# EAGLE design Fuente y sensor (EAGLE 5.08)
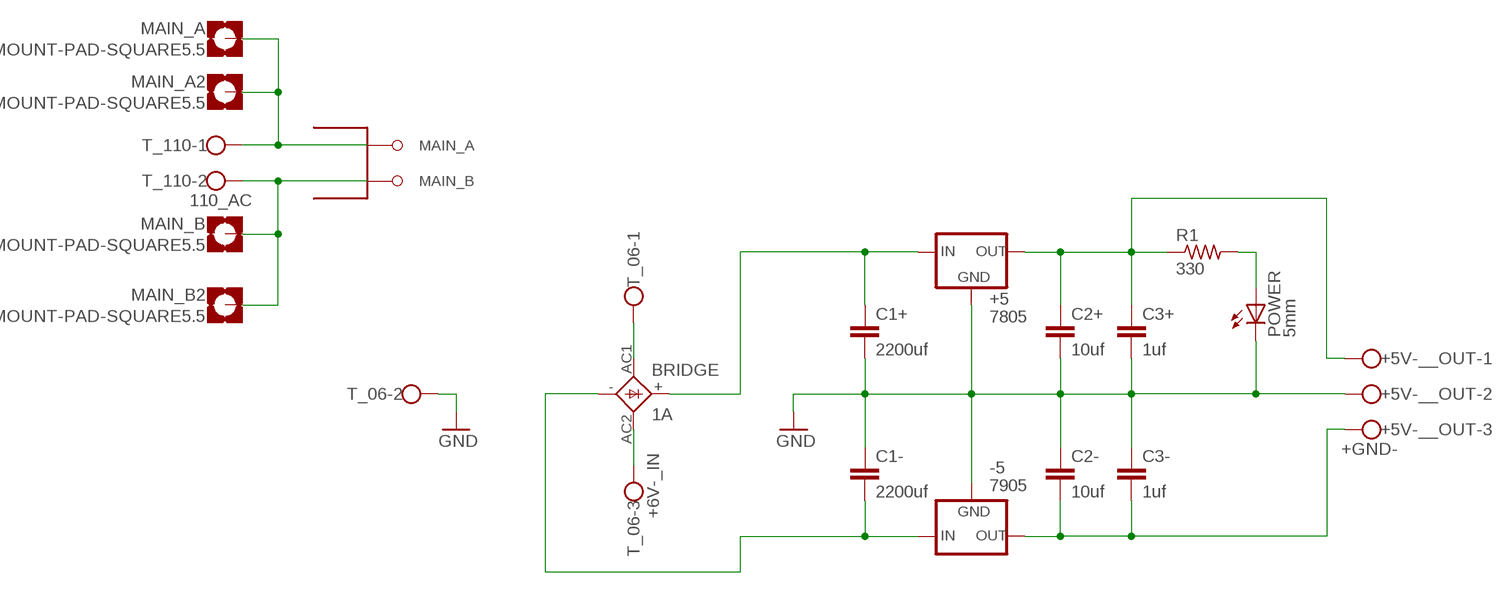
[diagram p0: schematic, sheet 1]

## Parts
+5  7805  78XXS  [78XXS]
+5V-__OUT  +GND-  W237-103  [W237-103]
-5  7905  79XXS  [79XXS]
BRIDGE  1A  2KBB-R  [2KBB-R]
C1+  2200uf  C-EU050-075X075  [C050-075X075]
C1-  2200uf  C-EU050-075X075  [C050-075X075]
C2+  10uf  C-EU025-060X050  [C025-060X050]
C2-  10uf  C-EU025-060X050  [C025-060X050]
C3+  1uf  C-EU025-060X050  [C025-060X050]
C3-  1uf  C-EU025-060X050  [C025-060X050]
MAIN_A  MOUNT-PAD-SQUARE5.5  [5,5-PAD-SQUARE]
MAIN_A2  MOUNT-PAD-SQUARE5.5  [5,5-PAD-SQUARE]
MAIN_B  MOUNT-PAD-SQUARE5.5  [5,5-PAD-SQUARE]
MAIN_B2  MOUNT-PAD-SQUARE5.5  [5,5-PAD-SQUARE]
MAIN_INLET  DAC-14  [APP_INLET]
POWER  5mm  LED5MM  [LED5MM]
R1  330  R-US_0207/12  [0207/12]
T_06  +6V-_IN  W237-03P  [W237-133]
T_110  110_AC  W237-02P  [W237-132]

## Nets
GND: +5.GND +5V-__OUT.2 -5.GND C1+.2 C1-.1 C2+.2 C2-.1 C3+.2 C3-.1 POWER.K(C) T_06.2
N$1: MAIN_A2.B5,5(MOUNT) MAIN_A.B5,5(MOUNT) MAIN_INLET.MAIN_A T_110.1
N$2: MAIN_B2.B5,5(MOUNT) MAIN_B.B5,5(MOUNT) MAIN_INLET.MAIN_B T_110.2
N$3: BRIDGE.AC1 T_06.1
N$4: BRIDGE.AC2 T_06.3
N$5: +5.IN BRIDGE.+ C1+.1
N$6: -5.IN BRIDGE.- C1-.2
N$7: POWER.A R1.2
N$8: +5.OUT +5V-__OUT.1 C2+.1 C3+.1 R1.1
N$11: +5V-__OUT.3 -5.OUT C2-.2 C3-.2

## Library data of the parts
+5 = v-reg:78XXS: VOLTAGE REGULATOR
+5V-__OUT = con-wago-500:W237-103: WAGO SCREW CLAMP
-5 = v-reg:79XXS: VOLTAGE REGULATOR
BRIDGE = rectifier:2KBB-R: RECTIFIER grid 3 x 5 mm
C1+ C1- C2+ C2- C3+ C3- = rcl:C-EU: CAPACITOR, European symbol
MAIN_A MAIN_A2 MAIN_B MAIN_B2 = holes:MOUNT-PAD-SQUARE: MOUNTING PAD, square
MAIN_INLET = Applet-inlet:DAC-14
POWER = led:LED: LED OSRAM: - CHIPLED LG R971, LG N971, LY N971, LG Q971, LY Q971, LO R971, LY R971 LH N974, LH R974 LS Q976, LO Q976, LY Q976 LO Q996 - Hyper CHIPLED LW Q18S LB Q993, LB Q99A, LB R99A - SideLED LS A670, LO A670, LY A670, LG A670, LP A670 LB A673, LV A673, LT A673, LW A673 LH A674 LY A675 LS A676, LA A676, LO A676, LY A676, LW A676 LS A679, LY A679, LG A679 - Hyper Micro SIDELED® LS Y876, LA Y876, LO Y876, LY Y876 LT Y87S - SmartLED LW L88C, LW L88S LB L89C, LB L89S, LG L890 LS L89K, LO L89K, LY L89K LS L896, LA L896, LO L896, LY L896 - TOPLED LS T670, LO T670, LY T670, LG T670, LP T670 LSG T670, LSP T670, LSY T670, LOP T670, LYG T670 LG T671, LOG T671, LSG T671 LB T673, LV T673, LT T673, LW T673 LH T674 LS T676, LA T676, LO T676, LY T676, LB T676, LH T676, LSB T676, LW T676 LB T67C, LV T67C, LT T67C, LS T67K, LO T67K, LY T67K, LW E67C LS E67B, LA E67B, LO E67B, LY E67B, LB E67C, LV E67C, LT E67C LW T67C LS T679, LY T679, LG T679 LS T770, LO T770, LY T770, LG T770, LP T770 LB T773, LV T773, LT T773, LW T773 LH T774 LS E675, LA E675, LY E675, LS T675 LS T776, LA T776, LO T776, LY T776, LB T776 LHGB T686 LT T68C, LB T68C - Hyper Mini TOPLED® LB M676 - Mini TOPLED Santana® LG M470 LS M47K, LO M47K, LY M47K Source: http://www.osram.convergy.de LUXEON: - LUMILED® LXK2-PW12-R00, LXK2-PW12-S00, LXK2-PW14-U00, LXK2-PW14-V00 LXK2-PM12-R00, LXK2-PM12-S00, LXK2-PM14-U00 LXK2-PE12-Q00, LXK2-PE12-R00, LXK2-PE12-S00, LXK2-PE14-T00, LXK2-PE14-U00 LXK2-PB12-K00, LXK2-PB12-L00, LXK2-PB12-M00, LXK2-PB14-N00, LXK2-PB14-P00, LXK2-PB14-Q00 LXK2-PR12-L00, LXK2-PR12-M00, LXK2-PR14-Q00, LXK2-PR14-R00 LXK2-PD12-Q00, LXK2-PD12-R00, LXK2-PD12-S00 LXK2-PH12-R00, LXK2-PH12-S00 LXK2-PL12-P00, LXK2-PL12-Q00, LXK2-PL12-R00 Source: www.luxeon.com KINGBRIGHT: KA-3528ASYC Source: www.kingbright.com
R1 = rcl:R-US_: RESISTOR, American symbol
T_06 = con-wago-508:W237-03P: WAGO SREW CLAMP
T_110 = con-wago-508:W237-02P: WAGO SREW CLAMP

## Board
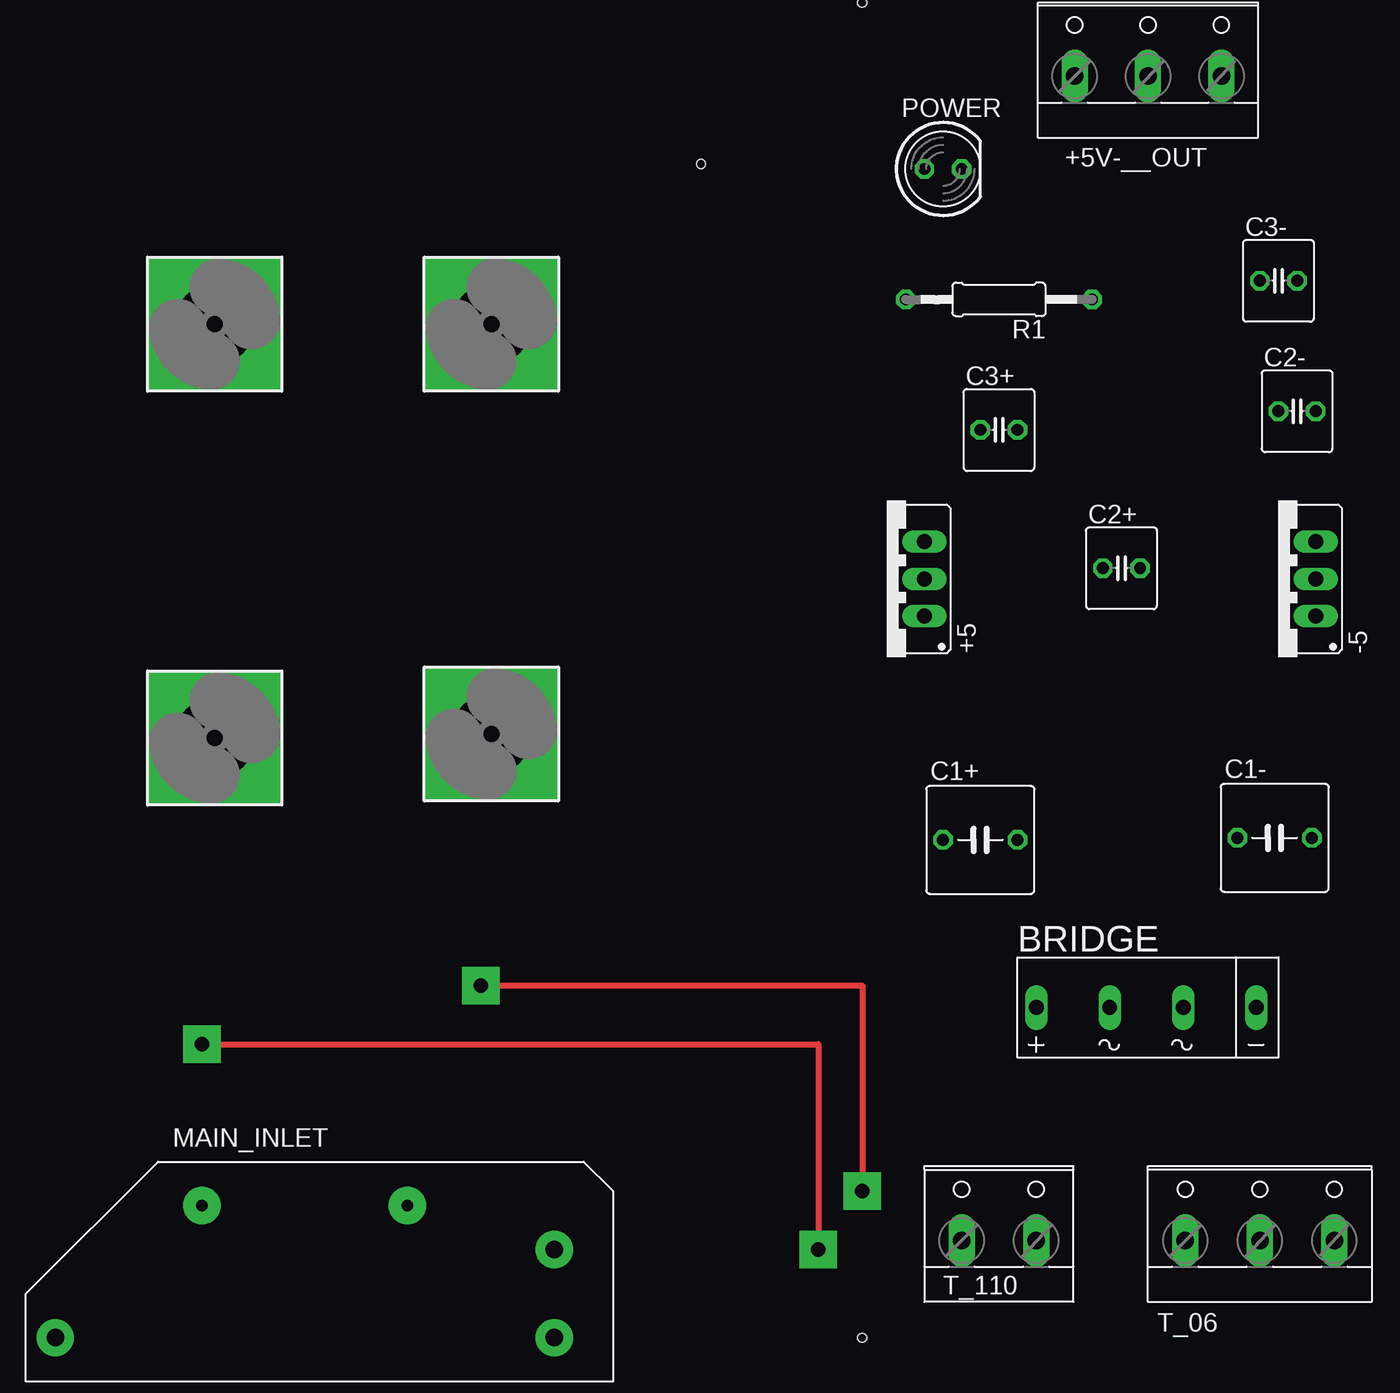
[diagram p1: board, top side]
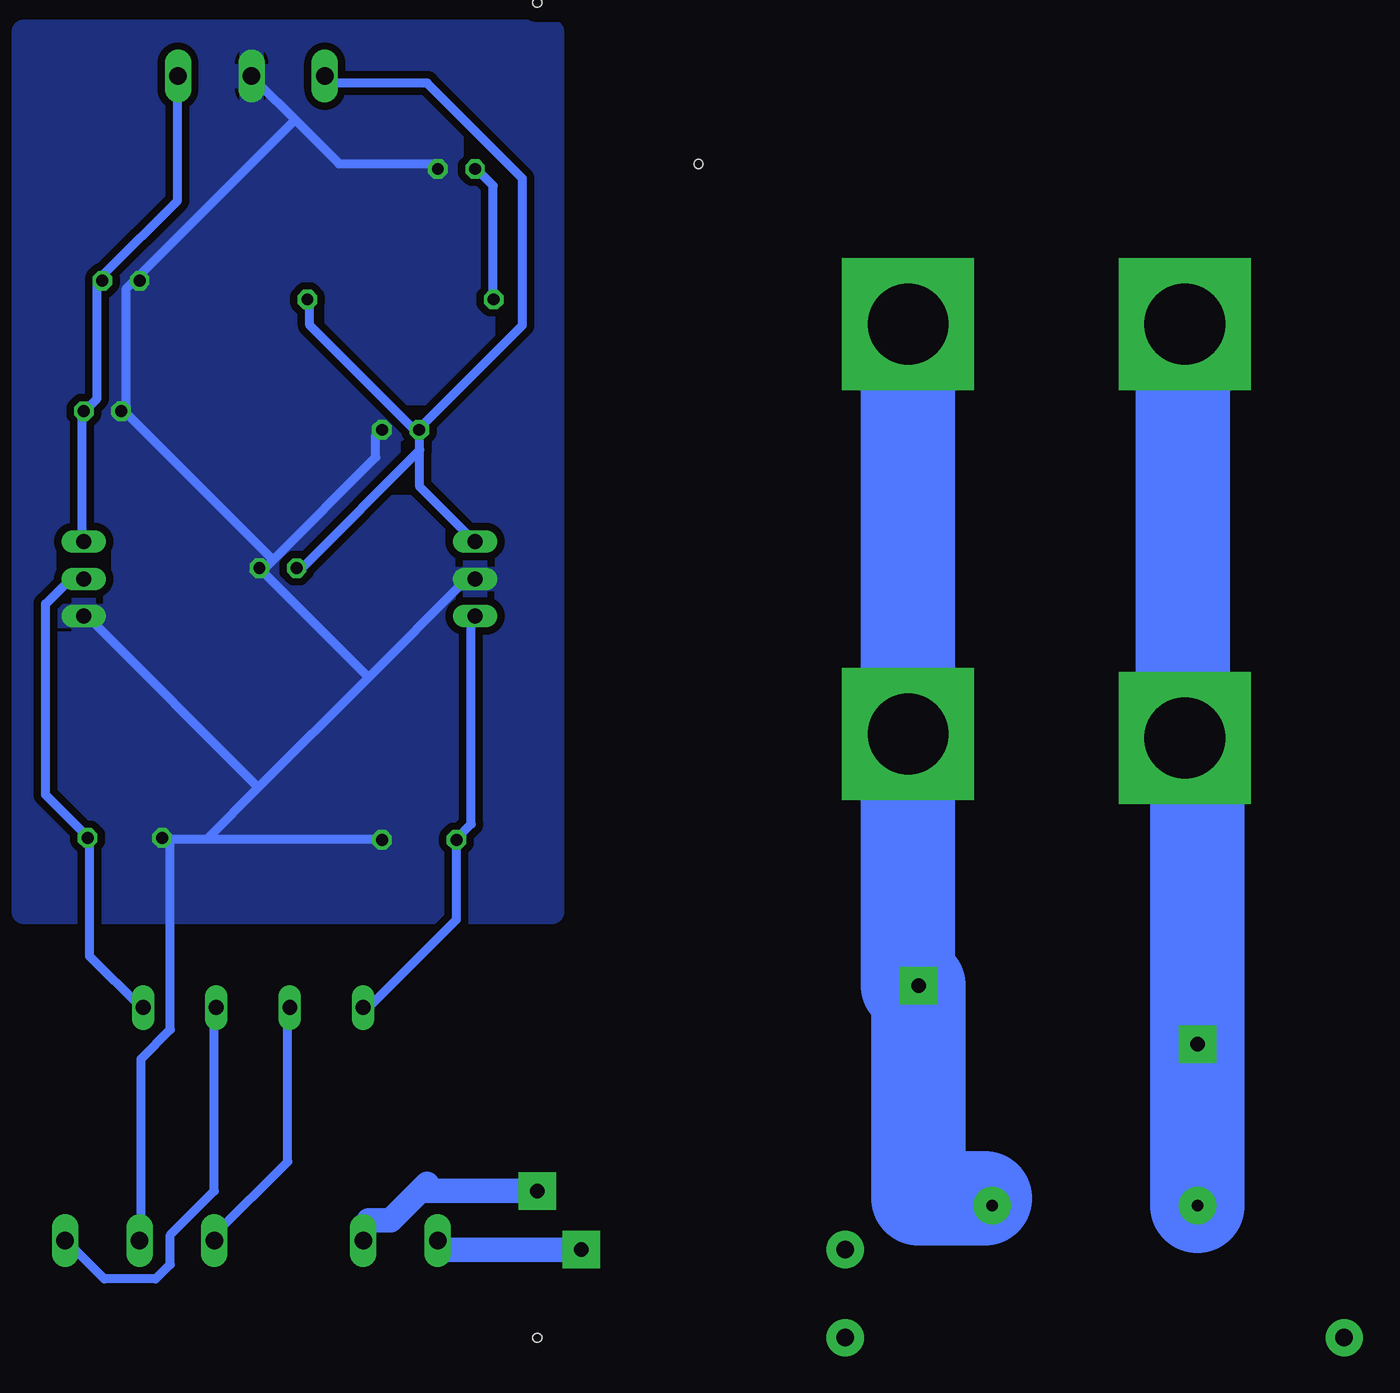
[diagram p2: board, bottom side, seen from below]

No outline drawn. Coordinates in mm, seen from the top.
Copper layers (1*16): Top 0.035mm / dielectric 1.5mm / Bottom 0.035mm
Design rules "16_clear_20_line *": minimum track width 24mil, minimum drill 24mil, track to track 20mil, track to pad 20mil, pad to pad 20mil, via to via 16mil, smd to smd 8mil, copper to edge 40mil, drill to drill 8mil, minimum pad ring 10mil, minimum via ring 8mil, stop-mask expansion 4mil, vias tented up to drill 0mil, thermal gap 10mil
Holes 0.6 mm at 5,1 5,87 57,87 56,1 68,7 68,98 108,98 108,7

### Footprints (pad centres in the part's own frame; a part is rotated, then mirrored left to right if it is on the bottom)
78XXS = drill 1.016 long: GND 0,-2.54; IN -2.54,-2.54; OUT 2.54,-2.54
W237-103 = drill 1.194 long: 1 -5,-1.29; 2 0,-1.29; 3 5,-1.29
79XXS = drill 1.016 long: GND -2.54,-2.54; IN 0,-2.54; OUT 2.54,-2.54
2KBB-R = drill 1.016 long: + -7.62,0; - 7.391,0; AC1 -2.616,0; AC2 2.413,0
C050-075X075 = drill 0.813 octagon: 1 -2.54,0; 2 2.54,0
C025-060X050 = drill 0.813 octagon: 1 -1.27,0; 2 1.27,0
5,5-PAD-SQUARE = drill 5.5 pad 9 square: B5,5 0,0
APP_INLET = drill 1.2 pad 2.54 round: HOLE_1 17,3; HOLE_2 17,-3; HOLE_3 -17,-3 | drill 0.8 pad 2.54 round: MAIN_A -7,6; MAIN_B 7,6
LED5MM = drill 0.813 octagon: A -1.27,0; K 1.27,0
0207/12 = drill 0.813 octagon: 1 -6.35,0; 2 6.35,0
W237-133 = drill 1.194 long: 1 -5.08,-0.635; 2 0,-0.635; 3 5.08,-0.635
W237-132 = drill 1.194 long: 1 -2.54,-0.635; 2 2.54,-0.635

### Placement (x,y rotation side)
+5  69.69,58.71 90 top
+5V-__OUT  87.47,94.27 0 top
-5  96.36,58.71 90 top
BRIDGE  87.47,29.5 0 top
C1+  76.04,40.93 0 top
C1-  96.1,41.07 0 top
C2+  85.66,59.44 0 top
C2-  97.63,70.14 0 top
C3+  77.31,68.87 0 top
C3-  96.36,79.03 0 top
MAIN_A  23.86,76.08 0 top
MAIN_A2  23.86,47.87 0 top
MAIN_B  42.72,48.14 0 top
MAIN_B2  42.72,76.08 0 top
MAIN_INLET  30,10 0 top
POWER  73.5,86.65 0 top
R1  77.31,77.76 180 top
T_06  95.09,14.26 0 top
T_110  77.31,14.26 0 top

### Tracks (layer width: path | path; a pad name or v marks a point on that pad's centre or on a via)
GND
  Bottom 0.61: 84.5,90 87,92.5 +5V-__OUT.2 | 84.5,90 81.5,87 75,87 POWER.K | 86,60 86.5,59.5 C2+.2 86.5,59 79.5,52 | 86,60 79,67 79,68.5 C3+.2 | 86,60 96,70 C2-.1 96,70.5 96,78.5 95.5,79 C3-.1 95,79.5 84.5,90 | 93,41 93.5,41 C1-.1 93,41 | 93,41 90.5,41 | 90.5,41 79,41 C1+.2 | 90.5,41 87,44.5 | 87,44.5 79.5,52 | 79.5,52 73,58.5 72.5,58.5 +5.GND | 87,44.5 98.5,56 -5.GND | 93,41 93,28 95,26 95,14 T_06.2
  pour Bottom: 68,36 103,36 103,96 67,96 67,36
N$1  (via drill 1 pad 2.54)
  Top 0.406: v23,27 65,27 v65,13
  Bottom 0.406: 74.77,13 T_110.1 | 23,47.87 MAIN_A2.B5,5 23.86,48 24,48 | 24,76.08 MAIN_A.B5,5
  Bottom 0.61: T_110.1 74.5,13.5
  Bottom 1.676: v65,13 74.77,13
  Bottom 6.452: MAIN_INLET.MAIN_A v23,27 23,47.87 | 24,48 24,76.08
N$2  (via drill 1 pad 2.54)
  Top 0.406: v42,31 68,31 v68,17
  Bottom 0.406: 75.5,17 75.5,17.5 | v42,31 42.72,31
  Bottom 0.61: MAIN_INLET.MAIN_B 37.5,16.5 | 79.5,15 T_110.2
  Bottom 1.676: 79.5,15 78,15 75.5,17.5 | v68,17 75.5,17
  Bottom 6.452: 37.5,16.5 42,16.5 v42,31 | 42.72,31 MAIN_B.B5,5 MAIN_B2.B5,5
N$3
  Bottom 0.61: BRIDGE.AC1 85,29.5 85,19 90,14 T_06.1
N$4
  Bottom 0.61: BRIDGE.AC2 90,29.5 90,17 93,14 93,12 94,11 97.5,11 100,13.5 T_06.3
N$5
  Bottom 0.61: BRIDGE.+ 79.5,29.5 73.5,35.5 C1+.1 73.5,41 72.5,42 72.5,56 +5.IN
N$6
  Bottom 0.61: BRIDGE.- 95,29.5 98.5,33 98.5,41 C1-.2 99,41.5 101.5,44 101.5,57 100,58.5 99,58.5 -5.IN
N$7
  Bottom 0.61: R1.2 71,78 71,85.5 72,86.5 POWER.A
N$8
  Bottom 0.61: 76,67.5 76,65 72.5,61.5 +5.OUT | 76,67.5 76,68.5 C3+.1 | 76,67.5 84,59.5 C2+.1 | R1.1 83.5,77.5 83.5,76 76.5,69 C3+.1 | +5V-__OUT.1 82,92.5 75.5,92.5 69,86 69,76 76,69 C3+.1
N$11
  Bottom 0.61: -5.OUT 99,61.5 99,70 C2-.2 98.5,70.5 98,71 98,79 C3-.2 97.5,79.5 92.5,84.5 92.5,92.5 +5V-__OUT.3